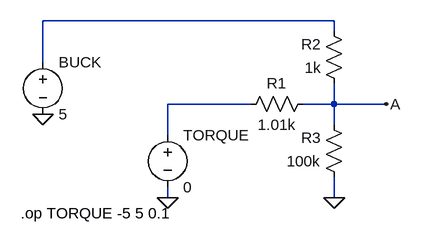
[diagram p0: schematic Passive_Divider.asc]
Passive_Divider.asc, the LTspice schematic file:
Version 4
SHEET 1 880 680
WIRE 544 32 96 32
WIRE 544 48 544 32
WIRE 96 96 96 32
WIRE 416 160 288 160
WIRE 544 160 544 128
WIRE 544 160 496 160
WIRE 624 160 544 160
WIRE 544 192 544 160
WIRE 288 208 288 160
WIRE 288 304 288 288
WIRE 544 304 544 272
FLAG 624 160 A
FLAG 96 176 0
FLAG 288 304 0
FLAG 544 304 0
DATAFLAG 608 160 ""
DATAFLAG 544 32 ""
DATAFLAG 368 160 ""
SYMBOL voltage 96 80 R0
WINDOW 123 0 0 Left 0
WINDOW 39 0 0 Left 0
SYMATTR InstName BUCK
SYMATTR Value 5
SYMBOL voltage 288 192 R0
WINDOW 123 0 0 Left 0
WINDOW 39 0 0 Left 0
SYMATTR InstName TORQUE
SYMATTR Value 0
SYMBOL res 512 144 R90
WINDOW 0 0 56 VBottom 2
WINDOW 3 32 56 VTop 2
SYMATTR InstName R1
SYMATTR Value 1.01k
SYMBOL res 560 144 R180
WINDOW 0 36 76 Left 2
WINDOW 3 36 40 Left 2
SYMATTR InstName R2
SYMATTR Value 1k
SYMBOL res 560 288 R180
WINDOW 0 36 76 Left 2
WINDOW 3 36 40 Left 2
SYMATTR InstName R3
SYMATTR Value 100k
TEXT 62 328 Left 2 !.op TORQUE -5 5 0.1

The netlist it stands for:
* Passive_Divider.asc
V§BUCK N001 0 5
V§TORQUE N002 0 0
R1 A N002 1.01k
R2 A N001 1k
R3 0 A 100k
.op TORQUE -5 5 0.1
.backanno
.end